# EAGLE design bma-001 (EAGLE 9.6.2)
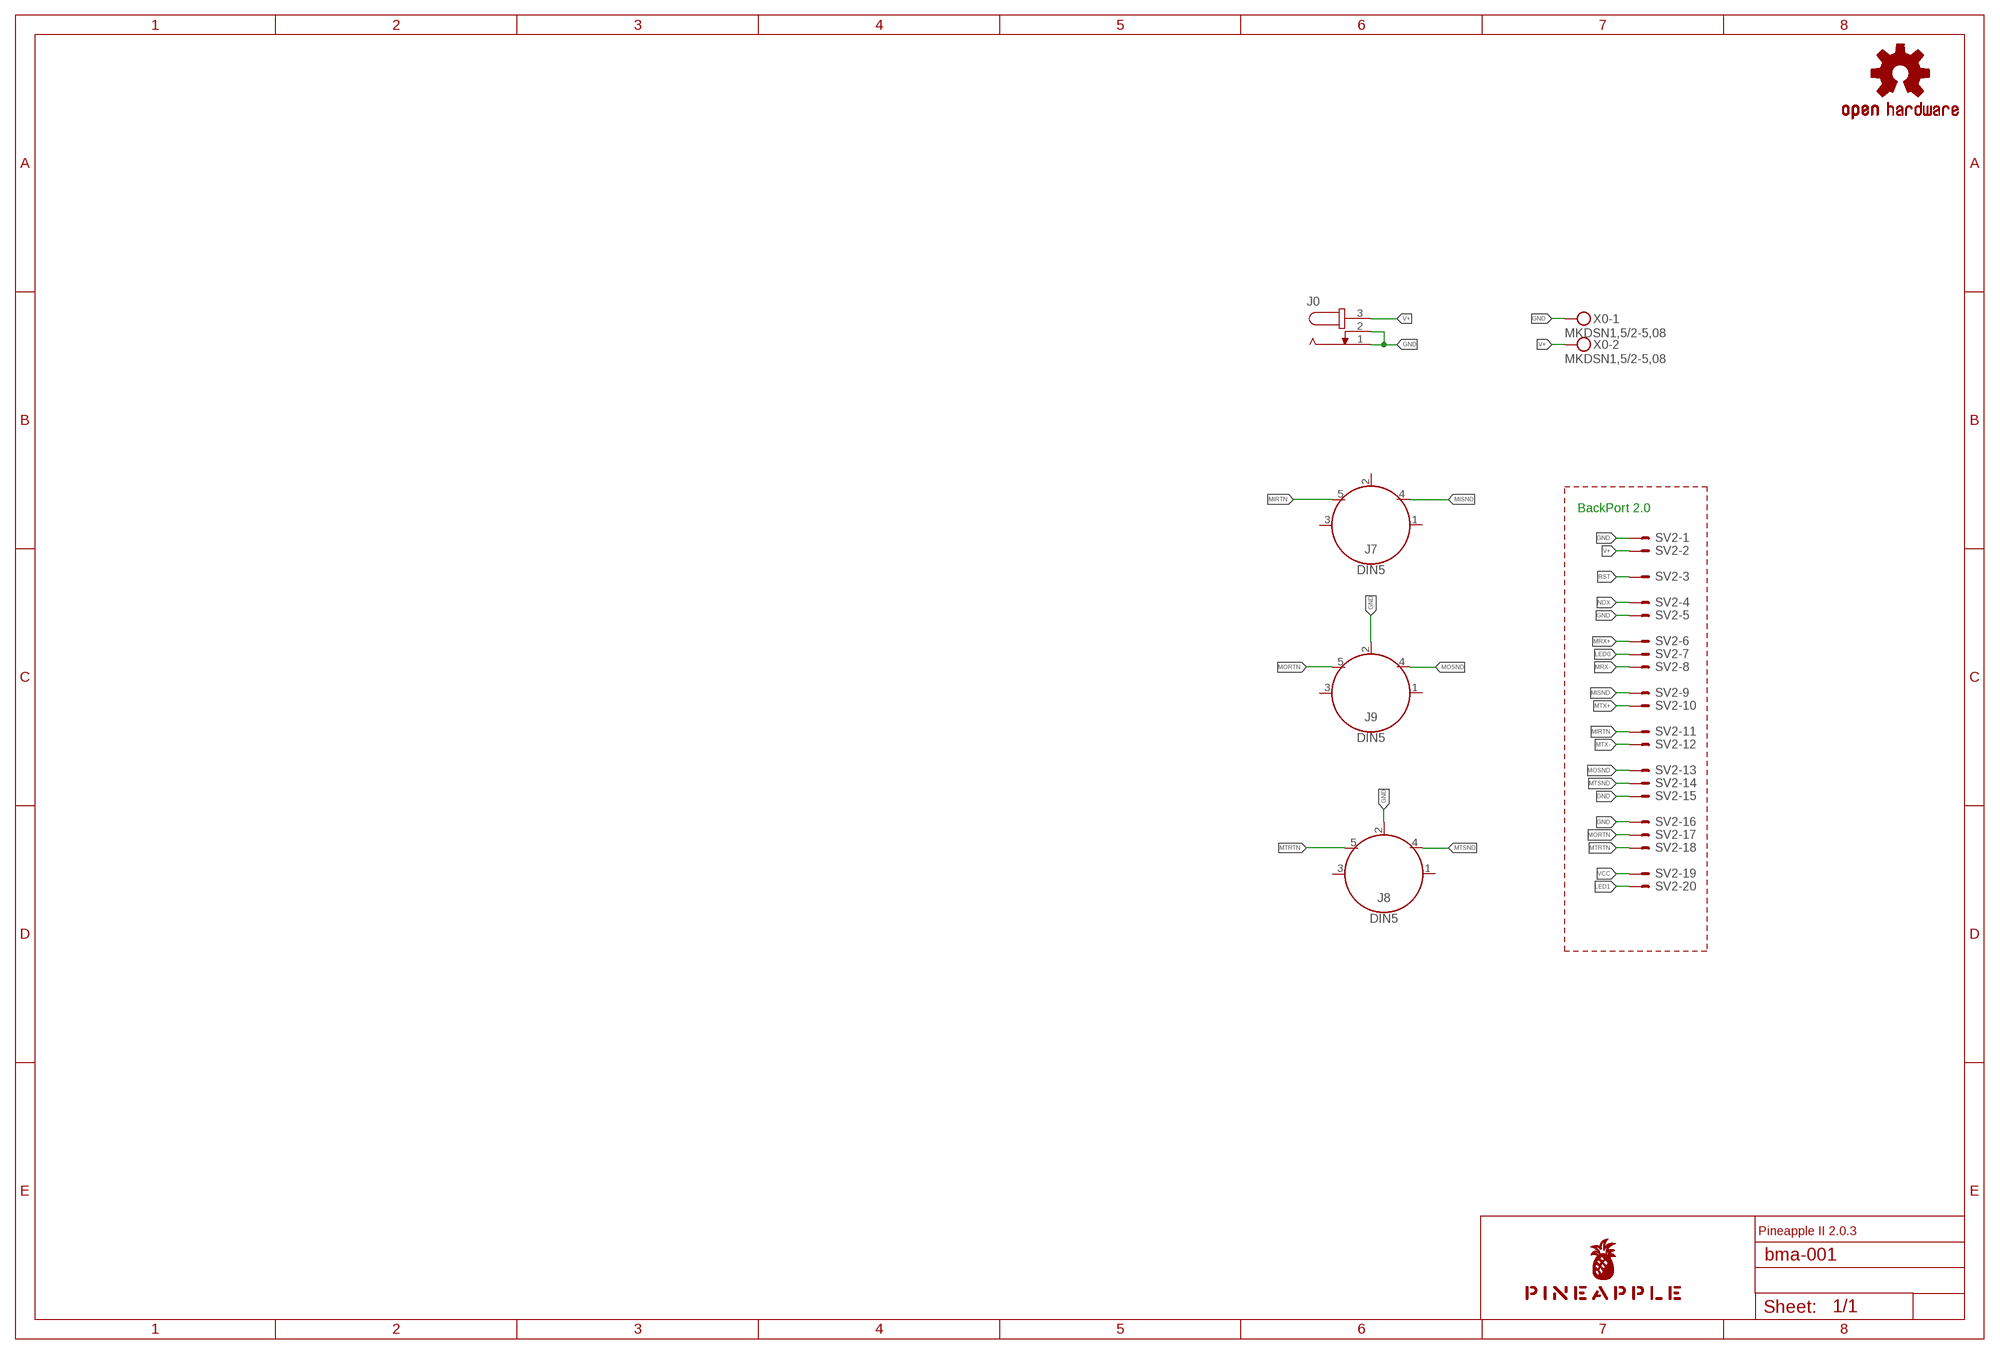
[diagram p0: schematic, sheet 1]

## Parts
J0  JACK-PLUG0  [SPC4077]
J7  DIN5  [DIN5-RA-PTH]
J8  DIN5  [DIN5-RA-PTH]
J9  DIN5  [DIN5-RA-PTH]
LOGO1  OSHW-LOGOS-COPPER  [OSHW-LOGO-S_COPPER]
SV2  ML20LE  [ML20L]
U$1  PINEAPPLE450_SILK  [PINEAPPLE450_SILK]
X0  MKDSN1,5/2-5,08  [MKDSN1,5/2-5,08]

## Nets
GND [gnd]: J0.1 J0.2 J8.2 J9.2 SV2.1 SV2.5 SV2.15 SV2.16 X0.1
LED0: SV2.7
LED1: SV2.20
MIRTN [external]: J7.5 SV2.11
MISND [external]: J7.4 SV2.9
MORTN: J9.5 SV2.17
MOSND: J9.4 SV2.13
MRX+: SV2.6
MRX-: SV2.8
MTRTN: J8.5 SV2.18
MTSND: J8.4 SV2.14
MTX+: SV2.10
MTX-: SV2.12
NDX: SV2.4
RST: SV2.3
V+ [superpower]: J0.3 SV2.2 X0.2
VCC [power]: SV2.19
Unconnected: J7.1 J7.2 J7.3 J8.1 J8.3 J9.1 J9.3

## Notes on the sheet
- BackPort 2.0
- Pineapple II 2.0.3

## Library data of the parts
J0 = con-jack:JACK-PLUG: DC POWER JACK Power Jack, DC, Right Angle, Through Hole, Rated 5A at 16VDC, PC Terminals Distributor: Farnell (www.Farnell.de) Drawing: 84N1161.pdf / 84N1162.pdf Manufacturer: SPC Technology (www.spctechnology.com) Type: SPC4077 / SPC 4078; OC_FARNELL: unknown; OC_NEWARK: unknown
J7-J9 = SparkFun-Connectors:DIN5: DIN5 Connector - Female Right Angle (frequently used as a MIDI Jack connector) This type of connector and cable is frequently used for transmitting midi data (musical instrument digital interface). It is what you usually see on a keyboard or set of electronic drums. Learn more here <https://en.wikipedia.org/wiki/MIDI>. For more information on the pinout and electrical specifications of MIDI communications, please see the following resource: https://www.midi.org/specifications/item/midi-din-electrical-specification Here is the connector we sell at SparkFun: MIDI Connector - Female Right Angle <https://www.sparkfun.com/products/9536> (PRT-09536) Datasheet <hhttp://www.sparkfun.com/datasheets/Prototyping/Connectors/MIDI-RA.pdf> It is used on this SparkFun product: SparkFun MIDI Shield <https://www.sparkfun.com/products/12898> (DEV-12898); PROD_ID: CONN-09481
LOGO1 = SparkFun-Aesthetics:OSHW-LOGO: Open-Source Hardware (OSHW) Logo This logo indicates the piece of hardware it is found on incorporates a OSHW license and/or adheres to the definition of open source hardware found here: http://freedomdefined.org/OSHW
SV2 = con-ml:ML20LE: HARTING; OC_FARNELL: unknown; OC_NEWARK: unknown
U$1 = pineapple:PINEAPPLE450_SILK
X0 = con-phoenix-508:MKDSN1,5/2-5,08: MKDSN 1,5/ 2-5,08 Printklemme Nennstrom: 13,5 A Nennspannung: 250 V Rastermaß: 5,08 mm Polzahl: 2 Anschlussart: Schraubanschluss Montage: Löten Anschlussrichtung Leiter/Platine: 0 ° Artikelnummer: 1729128 Source: http://eshop.phoenixcontact.com .. 1729128.pdf

## Net classes
0 default: width 0.152 mm, drill 0.152 mm, clearance 0.152 mm
1 gnd: width 0.305 mm, drill 0.152 mm, clearance 0.152 mm
2 power: width 0.508 mm, drill 0.152 mm, clearance 0.152 mm
3 analog: width 0.305 mm, drill 0.152 mm, clearance 0.152 mm
4 external: width 0.152 mm, drill 0.152 mm, clearance 0.152 mm
5 superpower: width 1.016 mm, drill 0.152 mm, clearance 0.152 mm

## Board
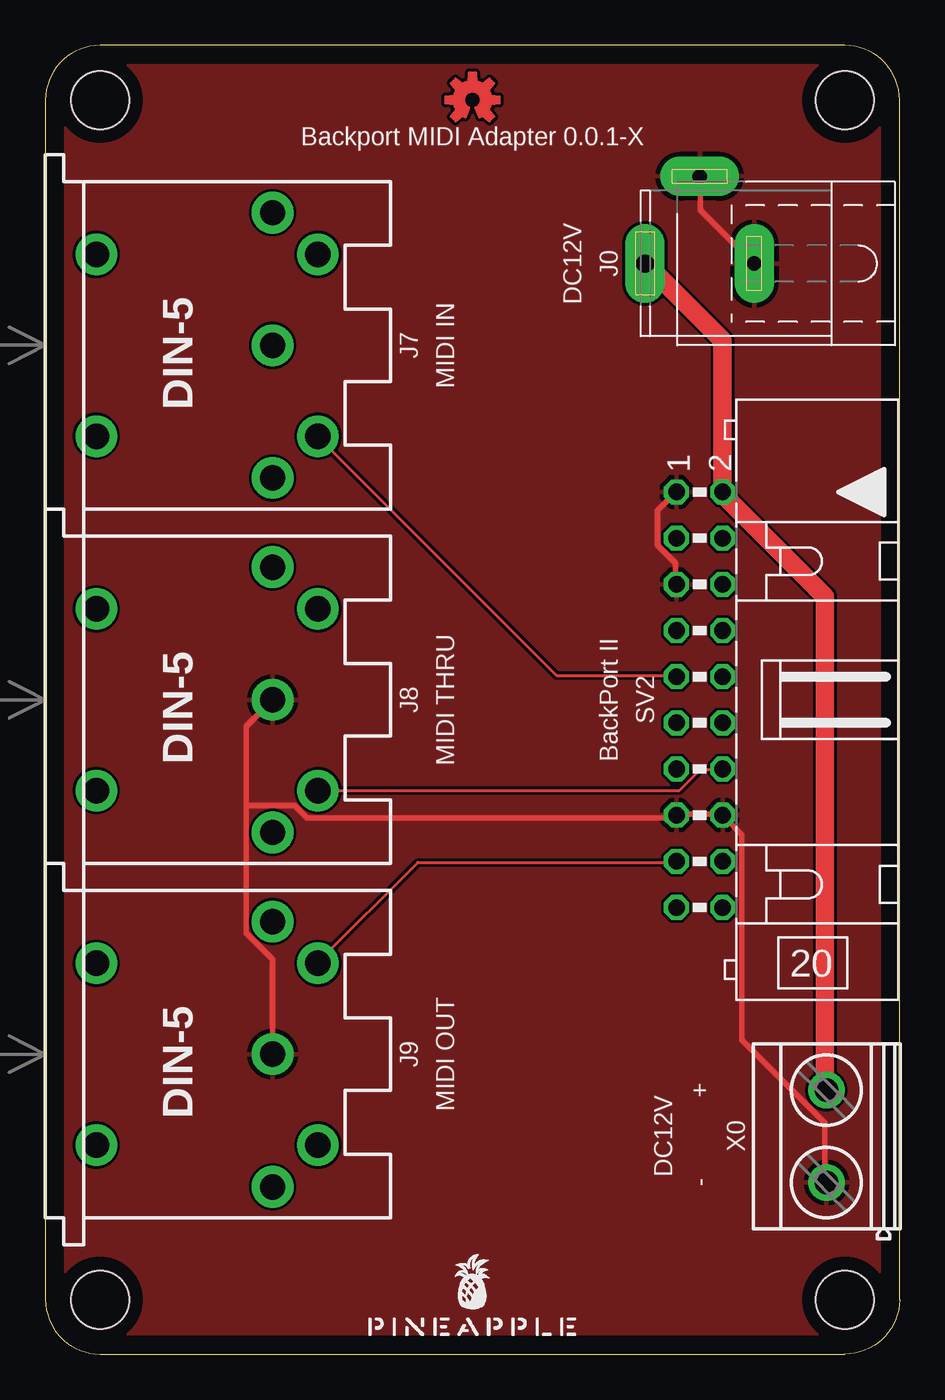
[diagram p1: board, top side]
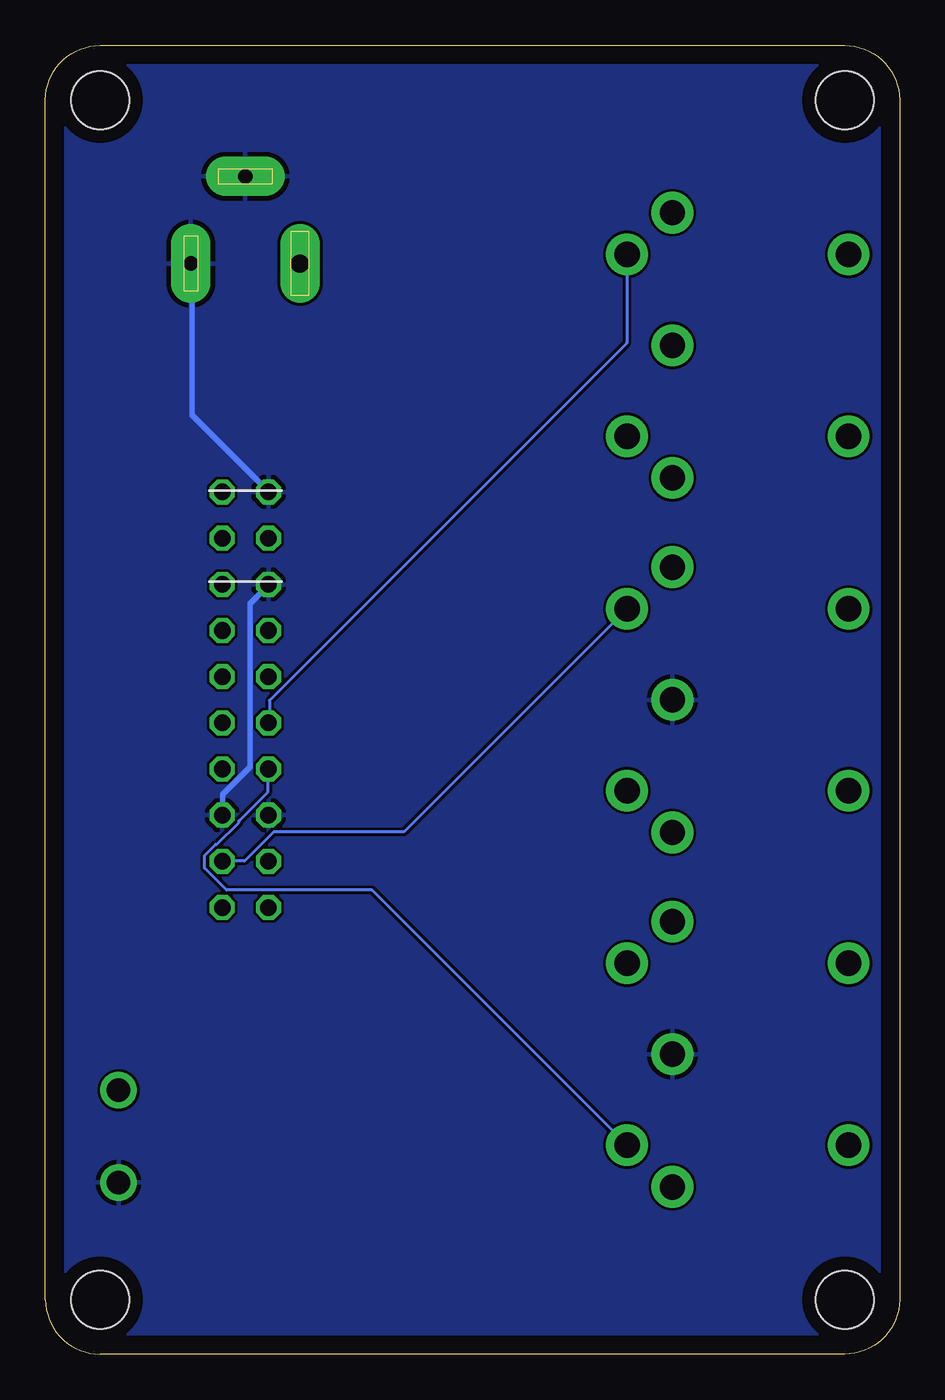
[diagram p2: board, bottom side, seen from below]

Size 47 x 72 mm. Coordinates in mm from the lower left corner, seen from the top.
Outline: 3,0 44,0 arc90 47,3 47,69 arc90 44,72 3,72 arc90 0,69 0,3 arc90 3,0
Copper layers (1*16): Top 0.035mm / dielectric 1.6mm / Bottom 0.035mm
Design rules "Elecrow_2-layer_PCB_eagle_rule": minimum track width 6mil, minimum drill 12mil, track to track 6mil, track to pad 6mil, pad to pad 6mil, via to via 8mil, smd to smd 0mil, copper to edge 20mil, drill to drill 10mil, minimum pad ring 6mil, minimum via ring 6mil, stop-mask expansion 0mil, vias tented up to drill 100mil, thermal gap 10mil
Holes 3.2 mm at 3,3 3,69 44,69 44,3
tRestrict: area 0.8,66.8 to 5.2,71.2; area 0.8,0.8 to 5.2,5.2; area 41.8,66.8 to 46.2,71.2; area 41.8,0.8 to 46.2,5.2; area 0,71 to 47,72; area 0,0 to 47,1; area 0,0 to 1,72; area 46,0 to 47,72
bRestrict: area 0.8,0.8 to 5.2,5.2; area 0.8,66.8 to 5.2,71.2; area 41.8,66.8 to 46.2,71.2; area 41.8,0.8 to 46.2,5.2; area 0,71 to 47,72; area 0,0 to 47,1; area 0,0 to 1,72; area 46,0 to 47,72

### Footprints (pad centres in the part's own frame; a part is rotated, then mirrored left to right if it is on the bottom)
SPC4077 = drill 0.8 pad 2.184 long: 1 -3,0; 2 0,-4.8 | drill 1 pad 2.184 long: 3 3,0
DIN5-RA-PTH = drill 1.4 pad 2.286: 1 7.3,12.5; 2 0,12.5; 3 -7.3,12.5; 4 5,15; 5 -5,15; 6 -5,2.8; 7 5,2.8
ML20L = drill 0.914 octagon: 1 -11.43,-1.27; 2 -11.43,1.27; 3 -8.89,-1.27; 4 -8.89,1.27; 5 -6.35,-1.27; 6 -6.35,1.27; 7 -3.81,-1.27; 8 -3.81,1.27; 9 -1.27,-1.27; 10 -1.27,1.27; 11 1.27,-1.27; 12 1.27,1.27; 13 3.81,-1.27; 14 3.81,1.27; 15 6.35,-1.27; 16 6.35,1.27; 17 8.89,-1.27; 18 8.89,1.27; 19 11.43,-1.27; 20 11.43,1.27
MKDSN1,5/2-5,08 = drill 1.3 pad 2: 1 -2.561,0.025; 2 2.519,0.025

### Placement (x,y rotation side)
J0  36,60 180 top
J7  0,55.5 270 top
J8  0,36 270 top
J9  0,16.5 270 top
LOGO1  23.5,69 0 top
SV2  36,36 270 top
U$1  23.5,1 0 top
X0  43,12 90 top

### Tracks (layer width: path | path; a pad name or v marks a point on that pad's centre or on a via)
GND
  Top 0.305: 11.05,30.18 11.05,34.52 12.5,35.97 J8.2 | 11.05,30.18 11.05,23.16 12.5,21.72 12.5,16.54 J9.2 | J0.2 36.04,64.77 36.04,62.94 38.94,60.05 J0.1 | SV2.5 34.67,42.37 34.67,43.51 33.68,44.5 33.68,46.41 34.67,47.4 SV2.1 | X0.1 42.9,9.45 42.9,12.72 38.33,17.3 38.33,28.57 37.34,29.57 SV2.16 37.26,29.72 34.75,29.72 SV2.15 34.59,29.64 34.44,29.49 14.4,29.49 13.72,30.18 11.05,30.18
  Bottom 0.305: SV2.16 37.26,29.72 37.26,30.79 35.74,32.31 35.74,41.3 34.75,42.29 SV2.5 | J0.1 38.94,59.97 38.94,51.66 34.75,47.47 SV2.1
  pour Top: -1,-1 48,-1 48,73 -1,73
  pour Bottom: -2,-2 49,-2 49,74 -2,74
MIRTN
  Bottom 0.152: SV2.11 34.67,34.75 34.67,35.97 15.01,55.63 15.01,60.43 J7.5
MISND
  Top 0.152: SV2.9 34.67,37.34 28.12,37.34 15.01,50.44 J7.4
MORTN
  Top 0.152: SV2.17 34.67,27.05 20.5,27.05 15.01,21.57 J9.5
MOSND
  Bottom 0.152: SV2.13 34.75,32.16 34.75,30.94 36.35,29.34 36.35,29.26 37.57,28.04 37.64,28.04 38.25,27.43 38.25,26.75 37.03,25.53 29.03,25.53 J9.4
MTRTN
  Bottom 0.152: SV2.18 37.26,27.13 36.04,27.13 34.44,28.73 27.28,28.73 J8.5
MTSND
  Top 0.152: SV2.14 37.26,32.16 36.04,32.16 34.9,31.01 15.01,31.01 J8.4
V+
  Top 1.016: J0.3 33.07,59.97 37.26,55.78 37.26,47.47 SV2.2 37.57,47.02 42.9,41.68 42.9,14.55 X0.2

### Text on the board
tNames: Backport MIDI Adapter 0.0.1-X | DC12V | MIDI IN | MIDI THRU | BackPort II | MIDI OUT | + | DC12V | -